# Altium schematic sheet DI.SchDoc
size A2; SheetNumber: 4; SheetTotal: 7
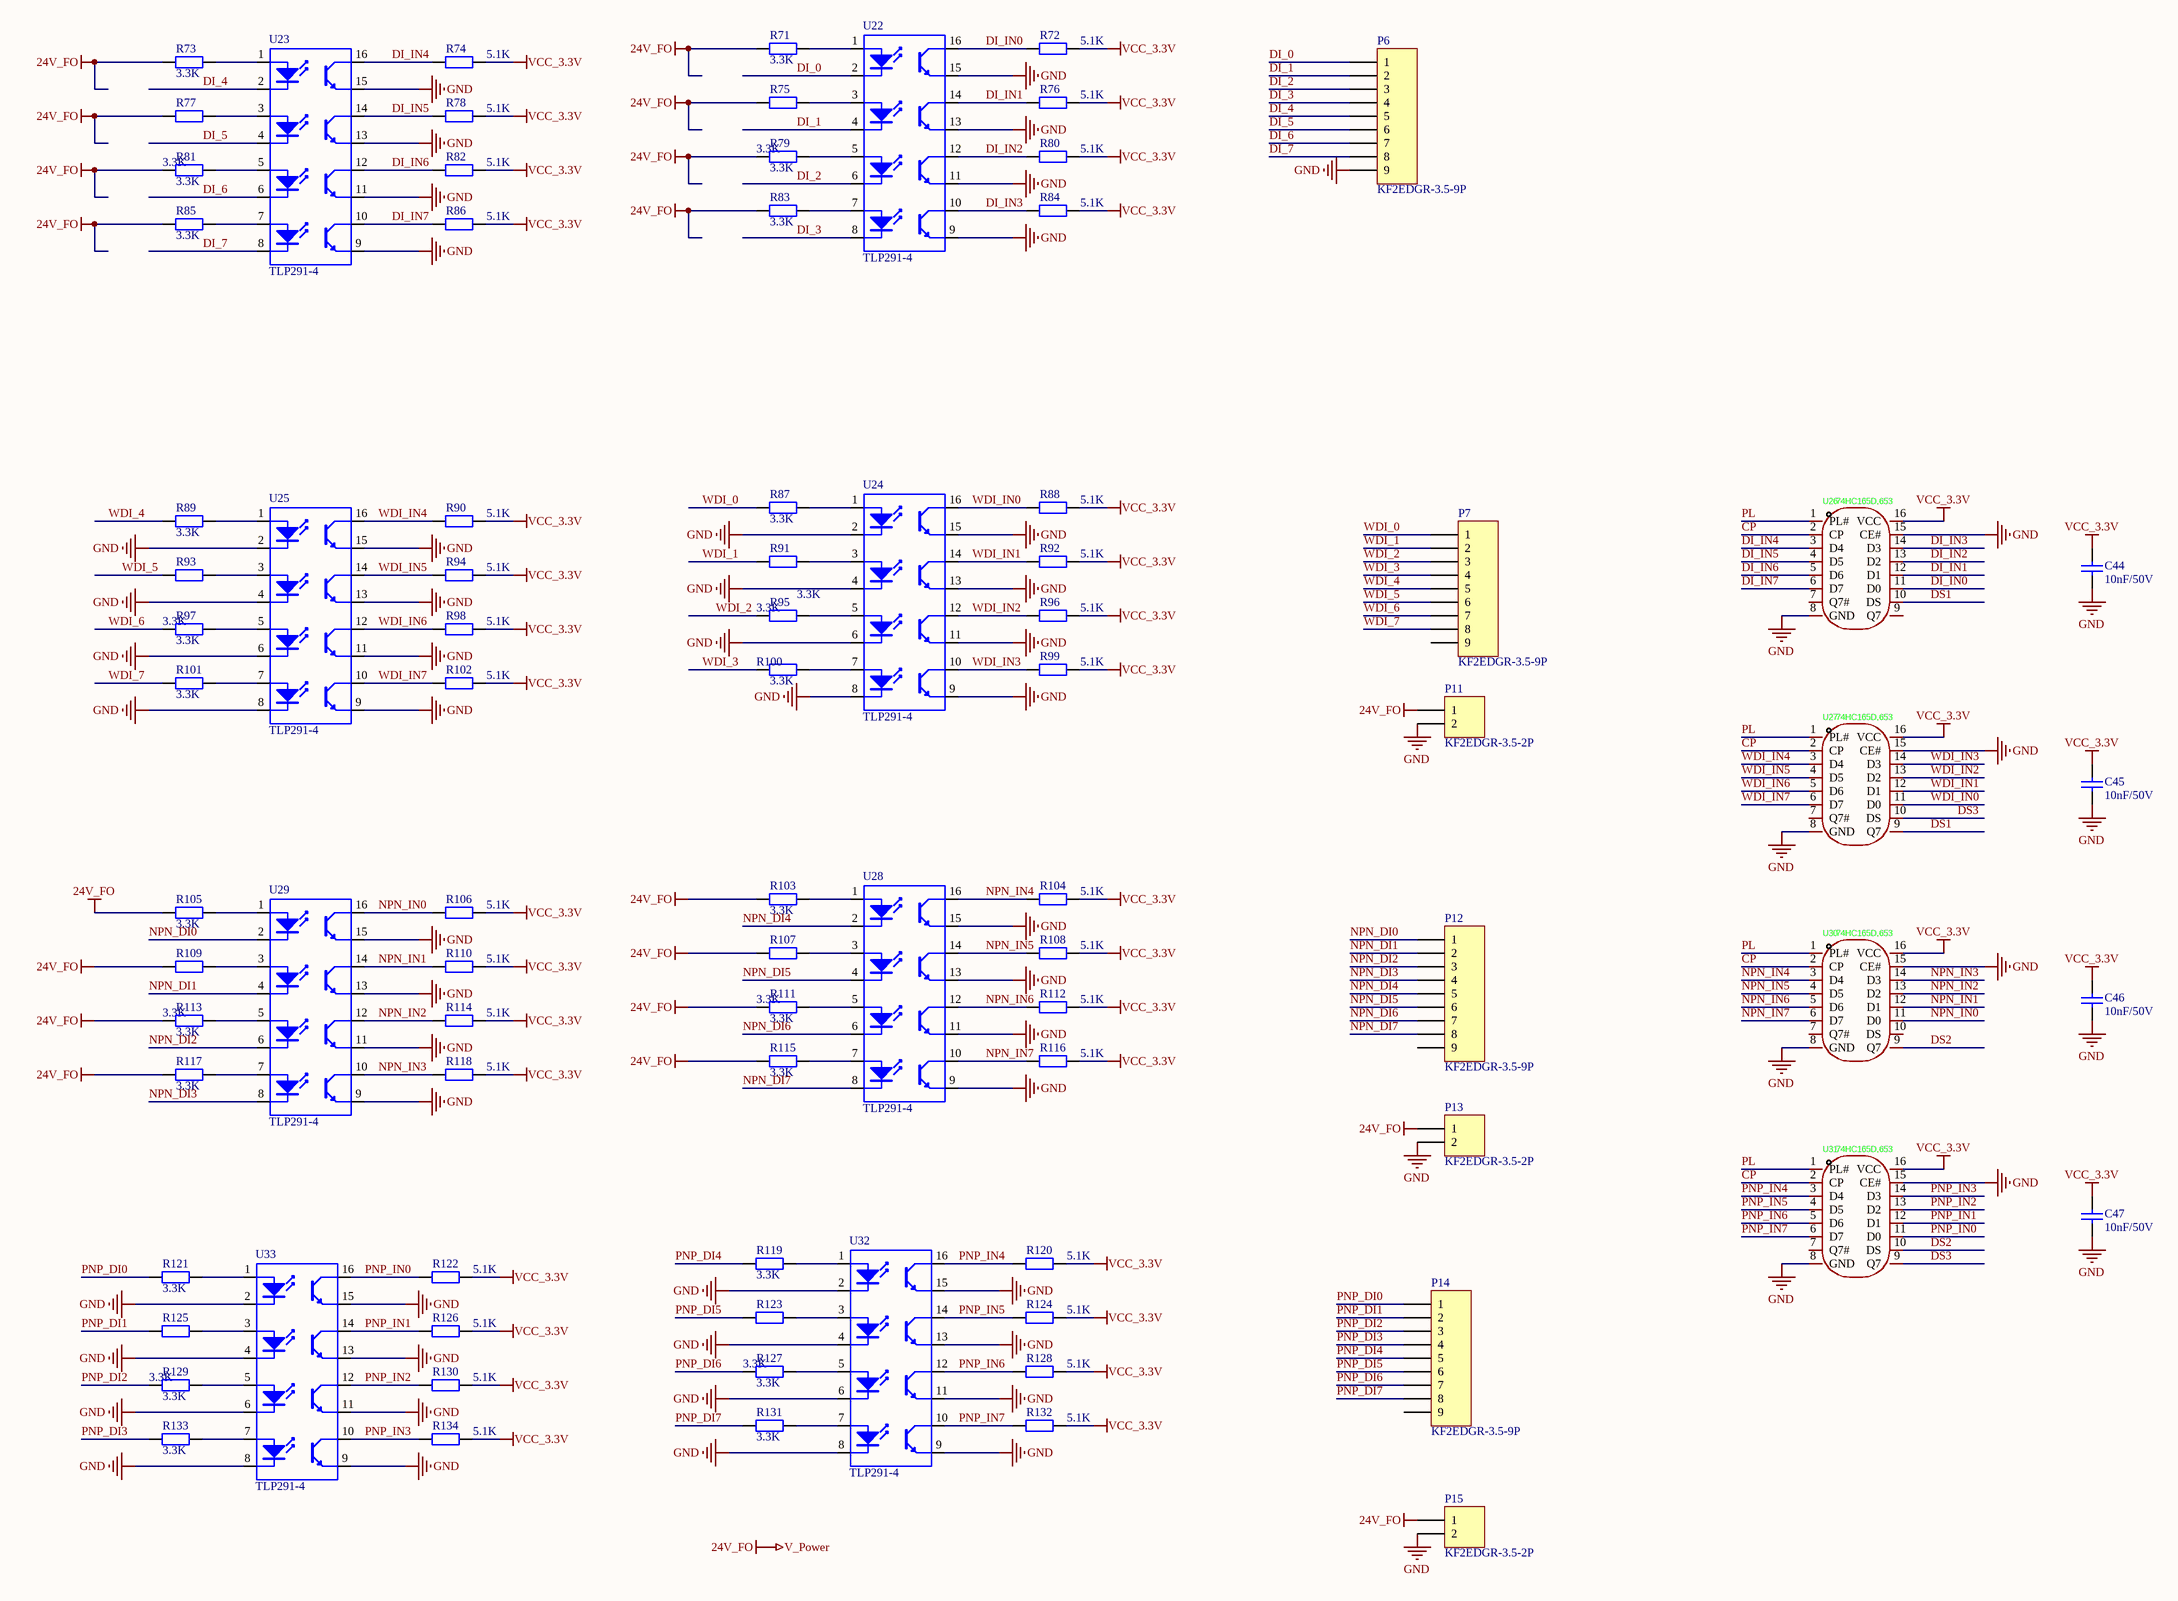
[diagram p0: DI.SchDoc]

## Parts
C44  10nF/50V  [0603C]
C45  10nF/50V  [0603C]
C46  10nF/50V  [0603C]
C47  10nF/50V  [0603C]
P6  KF2EDGR-3.5-9P  [CONN-TH_9P-P3.50_KF2EDGR-3.5-9P]
P7  KF2EDGR-3.5-9P  [CONN-TH_9P-P3.50_KF2EDGR-3.5-9P]
P11  KF2EDGR-3.5-2P  [CONN-TH_P3.50_KF2EDGR-3.5-2P]
P12  KF2EDGR-3.5-9P  [CONN-TH_9P-P3.50_KF2EDGR-3.5-9P]
P13  KF2EDGR-3.5-2P  [CONN-TH_P3.50_KF2EDGR-3.5-2P]
P14  KF2EDGR-3.5-9P  [CONN-TH_9P-P3.50_KF2EDGR-3.5-9P]
P15  KF2EDGR-3.5-2P  [CONN-TH_P3.50_KF2EDGR-3.5-2P]
R71  3.3K  [0603R]
R72  5.1K  [0603R]
R73  3.3K  [0603R]
R74  5.1K  [0603R]
R75  3.3K  [0603R]
R76  5.1K  [0603R]
R77  3.3K  [0603R]
R78  5.1K  [0603R]
R79  3.3K  [0603R]
R80  5.1K  [0603R]
R81  3.3K  [0603R]
R82  5.1K  [0603R]
R83  3.3K  [0603R]
R84  5.1K  [0603R]
R85  3.3K  [0603R]
R86  5.1K  [0603R]
R87  3.3K  [0603R]
R88  5.1K  [0603R]
R89  3.3K  [0603R]
R90  5.1K  [0603R]
R91  3.3K  [0603R]
R92  5.1K  [0603R]
R93  3.3K  [0603R]
R94  5.1K  [0603R]
R95  3.3K  [0603R]
R96  5.1K  [0603R]
R97  3.3K  [0603R]
R98  5.1K  [0603R]
R99  5.1K  [0603R]
R100  3.3K  [0603R]
R101  3.3K  [0603R]
R102  5.1K  [0603R]
R103  3.3K  [0603R]
R104  5.1K  [0603R]
R105  3.3K  [0603R]
R106  5.1K  [0603R]
R107  3.3K  [0603R]
R108  5.1K  [0603R]
R109  3.3K  [0603R]
R110  5.1K  [0603R]
R111  3.3K  [0603R]
R112  5.1K  [0603R]
R113  3.3K  [0603R]
R114  5.1K  [0603R]
R115  3.3K  [0603R]
R116  5.1K  [0603R]
R117  3.3K  [0603R]
R118  5.1K  [0603R]
R119  3.3K  [0603R]
R120  5.1K  [0603R]
R121  3.3K  [0603R]
R122  5.1K  [0603R]
R123  3.3K  [0603R]
R124  5.1K  [0603R]
R125  3.3K  [0603R]
R126  5.1K  [0603R]
R127  3.3K  [0603R]
R128  5.1K  [0603R]
R129  3.3K  [0603R]
R130  5.1K  [0603R]
R131  3.3K  [0603R]
R132  5.1K  [0603R]
R133  3.3K  [0603R]
R134  5.1K  [0603R]
U22  TLP291-4  [SOP16-T]
U23  TLP291-4  [SOP16-T]
U24  TLP291-4  [SOP16-T]
U25  TLP291-4  [SOP16-T]
U26  74HC165D,653  [SOP-16_L10.0-W3.9-P1.27-LS6.0-BL]
U27  74HC165D,653  [SOP-16_L10.0-W3.9-P1.27-LS6.0-BL]
U28  TLP291-4  [SOP16-T]
U29  TLP291-4  [SOP16-T]
U30  74HC165D,653  [SOP-16_L10.0-W3.9-P1.27-LS6.0-BL]
U31  74HC165D,653  [SOP-16_L10.0-W3.9-P1.27-LS6.0-BL]
U32  TLP291-4  [SOP16-T]
U33  TLP291-4  [SOP16-T]

## Nets
24V_FO: P11.1 P13.1 P15.1 R71.2 R73.2 R75.2 R77.2 R79.2 R81.2 R83.2 R85.2 R103.2 R105.2 R107.2 R109.2 R111.2 R113.2 R115.2 R117.2  [also labelled V_Power]
GND: C44.1 C45.1 C46.1 C47.1 P6.9 P11.2 P13.2 P15.2 U22.9(E) U22.11(E) U22.13(E) U22.15(E) U23.9(E) U23.11(E) U23.13(E) U23.15(E) U24.2(K) U24.4(K) U24.6(K) U24.8(K) U24.9(E) U24.11(E) U24.13(E) U24.15(E) U25.2(K) U25.4(K) U25.6(K) U25.8(K) U25.9(E) U25.11(E) U25.13(E) U25.15(E) U26.8(GND) U26.15(CE#) U27.8(GND) U27.15(CE#) U28.9(E) U28.11(E) U28.13(E) U28.15(E) U29.9(E) U29.11(E) U29.13(E) U29.15(E) U30.8(GND) U30.15(CE#) U31.8(GND) U31.15(CE#) U32.2(K) U32.4(K) U32.6(K) U32.8(K) U32.9(E) U32.11(E) U32.13(E) U32.15(E) U33.2(K) U33.4(K) U33.6(K) U33.8(K) U33.9(E) U33.11(E) U33.13(E) U33.15(E)
VCC_3.3V: C44.2 C45.2 C46.2 C47.2 R72.1 R74.1 R76.1 R78.1 R80.1 R82.1 R84.1 R86.1 R88.1 R90.1 R92.1 R94.1 R96.1 R98.1 R99.1 R102.1 R104.1 R106.1 R108.1 R110.1 R112.1 R114.1 R116.1 R118.1 R120.1 R122.1 R124.1 R126.1 R128.1 R130.1 R132.1 R134.1 U26.16(VCC) U27.16(VCC) U30.16(VCC) U31.16(VCC)
CP: U26.2(CP) U27.2(CP) U30.2(CP) U31.2(CP)
DI_0: P6.1 U22.2(K)
DI_1: P6.2 U22.4(K)
DI_2: P6.3 U22.6(K)
DI_3: P6.4 U22.8(K)
DI_4: P6.5 U23.2(K)
DI_5: P6.6 U23.4(K)
DI_6: P6.7 U23.6(K)
DI_7: P6.8 U23.8(K)
DI_IN0: R72.2 U22.16(C) U26.11(D0)
DI_IN1: R76.2 U22.14(C) U26.12(D1)
DI_IN2: R80.2 U22.12(C) U26.13(D2)
DI_IN3: R84.2 U22.10(C) U26.14(D3)
DI_IN4: R74.2 U23.16(C) U26.3(D4)
DI_IN5: R78.2 U23.14(C) U26.4(D5)
DI_IN6: R82.2 U23.12(C) U26.5(D6)
DI_IN7: R86.2 U23.10(C) U26.6(D7)
DS1: U26.10(DS) U27.9(Q7)
DS2: U30.9(Q7) U31.10(DS)
DS3: U27.10(DS) U31.9(Q7)
NPN_DI0: P12.1 U29.2(K)
NPN_DI1: P12.2 U29.4(K)
NPN_DI2: P12.3 U29.6(K)
NPN_DI3: P12.4 U29.8(K)
NPN_DI4: P12.5 U28.2(K)
NPN_DI5: P12.6 U28.4(K)
NPN_DI6: P12.7 U28.6(K)
NPN_DI7: P12.8 U28.8(K)
NPN_IN0: R106.2 U29.16(C) U30.11(D0)
NPN_IN1: R110.2 U29.14(C) U30.12(D1)
NPN_IN2: R114.2 U29.12(C) U30.13(D2)
NPN_IN3: R118.2 U29.10(C) U30.14(D3)
NPN_IN4: R104.2 U28.16(C) U30.3(D4)
NPN_IN5: R108.2 U28.14(C) U30.4(D5)
NPN_IN6: R112.2 U28.12(C) U30.5(D6)
NPN_IN7: R116.2 U28.10(C) U30.6(D7)
PL: U26.1(PL#) U27.1(PL#) U30.1(PL#) U31.1(PL#)
PNP_DI0: P14.1 R121.2
PNP_DI1: P14.2 R125.2
PNP_DI2: P14.3 R129.2
PNP_DI3: P14.4 R133.2
PNP_DI4: P14.5 R119.2
PNP_DI5: P14.6 R123.2
PNP_DI6: P14.7 R127.2
PNP_DI7: P14.8 R131.2
PNP_IN0: R122.2 U31.11(D0) U33.16(C)
PNP_IN1: R126.2 U31.12(D1) U33.14(C)
PNP_IN2: R130.2 U31.13(D2) U33.12(C)
PNP_IN3: R134.2 U31.14(D3) U33.10(C)
PNP_IN4: R120.2 U31.3(D4) U32.16(C)
PNP_IN5: R124.2 U31.4(D5) U32.14(C)
PNP_IN6: R128.2 U31.5(D6) U32.12(C)
PNP_IN7: R132.2 U31.6(D7) U32.10(C)
WDI_0: P7.1 R87.2
WDI_1: P7.2 R91.2
WDI_2: P7.3 R95.2
WDI_3: P7.4 R100.2
WDI_4: P7.5 R89.2
WDI_5: P7.6 R93.2
WDI_6: P7.7 R97.2
WDI_7: P7.8 R101.2
WDI_IN0: R88.2 U24.16(C) U27.11(D0)
WDI_IN1: R92.2 U24.14(C) U27.12(D1)
WDI_IN2: R96.2 U24.12(C) U27.13(D2)
WDI_IN3: R99.2 U24.10(C) U27.14(D3)
WDI_IN4: R90.2 U25.16(C) U27.3(D4)
WDI_IN5: R94.2 U25.14(C) U27.4(D5)
WDI_IN6: R98.2 U25.12(C) U27.5(D6)
WDI_IN7: R102.2 U25.10(C) U27.6(D7)
NetR71_1: R71.1 U22.1(A)
NetR73_1: R73.1 U23.1(A)
NetR75_1: R75.1 U22.3(A)
NetR77_1: R77.1 U23.3(A)
NetR79_1: R79.1 U22.5(A)
NetR81_1: R81.1 U23.5(A)
NetR83_1: R83.1 U22.7(A)
NetR85_1: R85.1 U23.7(A)
NetR87_1: R87.1 U24.1(A)
NetR89_1: R89.1 U25.1(A)
NetR91_1: R91.1 U24.3(A)
NetR93_1: R93.1 U25.3(A)
NetR95_1: R95.1 U24.5(A)
NetR97_1: R97.1 U25.5(A)
NetR100_1: R100.1 U24.7(A)
NetR101_1: R101.1 U25.7(A)
NetR103_1: R103.1 U28.1(A)
NetR105_1: R105.1 U29.1(A)
NetR107_1: R107.1 U28.3(A)
NetR109_1: R109.1 U29.3(A)
NetR111_1: R111.1 U28.5(A)
NetR113_1: R113.1 U29.5(A)
NetR115_1: R115.1 U28.7(A)
NetR117_1: R117.1 U29.7(A)
NetR119_1: R119.1 U32.1(A)
NetR121_1: R121.1 U33.1(A)
NetR123_1: R123.1 U32.3(A)
NetR125_1: R125.1 U33.3(A)
NetR127_1: R127.1 U32.5(A)
NetR129_1: R129.1 U33.5(A)
NetR131_1: R131.1 U32.7(A)
NetR133_1: R133.1 U33.7(A)

Not connected (* = marked no-connect by the designer): P7 9; P12 9; P14 9; U26 7(Q7#) 9(Q7); U27 7(Q7#); U30 7(Q7#) 10(DS); U31 7(Q7#)

## Library data of the parts
C44-C47 = Cap: Capacitor; Value: 10nF/50V
P6 P7 P12 P14 = Header 9: Header, 9-Pin
P11 P13 P15 = Header 2: Header, 2-Pin
R71-R134 = Res0805M
U22-U25 U28 U29 U32 U33 = TLP281-4